# EAGLE schematic Driver motor L298N (EAGLE 9.1.0)
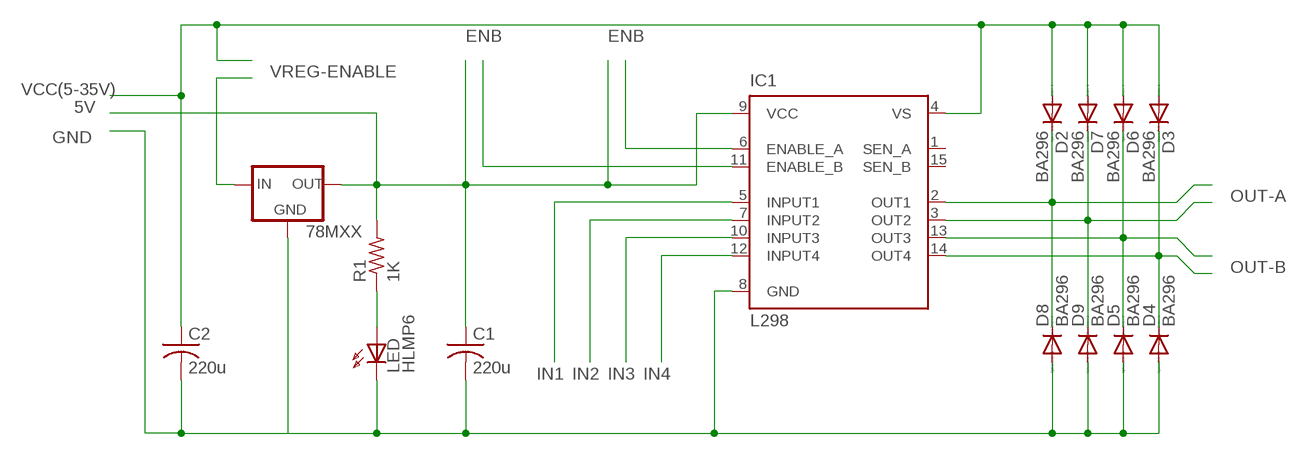
[diagram p0: schematic, sheet 1]

## Parts
78MXX  78LXX  [78LXX]
C1  220u  C-US025-024X044  [C025-024X044]
C2  220u  C-US025-024X044  [C025-024X044]
D2  BA296  [P2-15]
D3  BA296  [P2-15]
D4  BA296  [P2-15]
D5  BA296  [P2-15]
D6  BA296  [P2-15]
D7  BA296  [P2-15]
D8  BA296  [P2-15]
D9  BA296  [P2-15]
IC1  L298  [MULTIWATT-15]
LED  HLMP6  [HLMP6]
R1  1K  R-US_0204/2V  [0204V]

## Nets
ENB: 78MXX.OUT C1.1 IC1.9(VCC) R1.2
GND: C1.2 C2.2 D4.A D5.A D8.A D9.A IC1.8(GND) LED.K
IN1: IC1.5(INPUT1)
IN2: IC1.7(INPUT2)
IN3: IC1.10(INPUT3)
IN4: IC1.12(INPUT4)
N$2: 78MXX.GND
N$4: LED.A R1.1
N$5: IC1.11(ENABLE_B)
N$8: IC1.6(ENABLE_A)
N$14: D3.C D4.C IC1.14(OUT4)
N$19: D5.C D6.C IC1.13(OUT3)
N$20: D7.C D9.C IC1.3(OUT2)
N$21: D2.C D8.C IC1.2(OUT1)
VCC(5-35V): C2.1 D2.A D3.A D6.A D7.A IC1.4(VS)
VREG-ENABLE: 78MXX.IN
Unconnected: IC1.1(SEN_A) IC1.15(SEN_B)

## Library data of the parts
78MXX = v-reg:78LXX: VOLTAGE REGULATOR
C1 C2 = rcl:C-US: CAPACITOR, American symbol; SPICEPREFIX: C
D2-D9 = diode:BA296: DIODE
IC1 = st-microelectronics:L298: DUAL FULL-BRIDGE DRIVER; MPN: L298N; OC_FARNELL: 1589425; OC_NEWARK: 32M1527
LED = display-hp:HLMP6: LED 2mm horizontal; MF: AGILENT TECHNOLOGIES; MPN: HLMP-6500; OC_FARNELL: 1652490; OC_NEWARK: 40K0088
R1 = resistor:R-US_: RESISTOR, American symbol